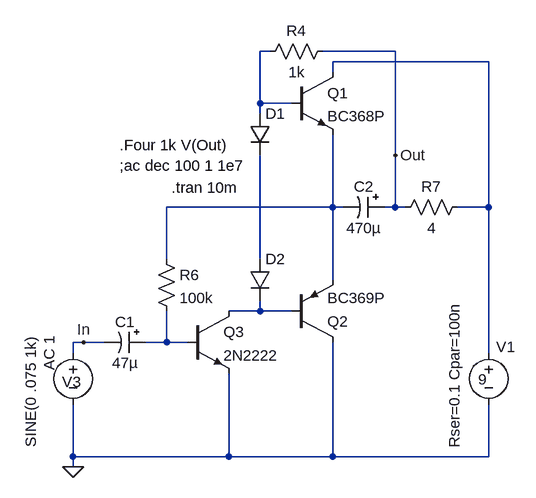
[diagram p0: schematic 9vMini25Ohms.asc]
9vMini25Ohms.asc, the LTspice schematic file:
Version 4
SHEET 1 880 756
WIRE -256 560 -256 544
WIRE -256 720 -256 640
WIRE -256 736 -256 720
WIRE -240 544 -256 544
WIRE -208 544 -240 544
WIRE -112 416 -112 336
WIRE -112 544 -144 544
WIRE -112 544 -112 496
WIRE -80 544 -112 544
WIRE -16 720 -256 720
WIRE -16 720 -16 592
WIRE 32 176 32 96
WIRE 32 192 32 176
WIRE 32 416 32 256
WIRE 32 496 -16 496
WIRE 32 496 32 480
WIRE 48 96 32 96
WIRE 80 176 32 176
WIRE 80 496 32 496
WIRE 144 128 144 112
WIRE 144 336 -112 336
WIRE 144 336 144 224
WIRE 144 448 144 336
WIRE 144 720 -16 720
WIRE 144 720 144 544
WIRE 160 336 144 336
WIRE 240 96 128 96
WIRE 240 256 240 96
WIRE 240 336 224 336
WIRE 240 336 240 256
WIRE 256 336 240 336
WIRE 384 112 144 112
WIRE 384 336 336 336
WIRE 384 336 384 112
WIRE 384 560 384 336
WIRE 384 720 144 720
WIRE 384 720 384 640
FLAG -256 736 0
FLAG 240 256 Out
FLAG -240 544 In
SYMBOL diode 16 192 R0
WINDOW 3 24 72 Invisible 0
SYMATTR Value 1N914
SYMATTR InstName D1
SYMBOL diode 16 416 R0
WINDOW 3 24 72 Invisible 0
SYMATTR Value 1N914
SYMATTR InstName D2
SYMBOL pnp2 80 544 M180
SYMATTR InstName Q2
SYMATTR Value BC369P
SYMBOL npn2 80 128 R0
SYMATTR InstName Q1
SYMATTR Value BC368P
SYMBOL npn2 -80 496 R0
SYMATTR InstName Q3
SYMATTR Value 2N2222
SYMBOL res 32 112 R270
WINDOW 0 32 56 VTop 0
WINDOW 3 0 56 VBottom 0
SYMATTR InstName R4
SYMATTR Value 1k
SYMATTR SpiceLine tol=1 pwr=0.1
SYMBOL res -128 400 R0
SYMATTR InstName R6
SYMATTR Value 100k
SYMATTR SpiceLine tol=1 pwr=0.1
SYMBOL res 240 352 R270
WINDOW 0 32 56 VTop 0
WINDOW 3 0 56 VBottom 0
SYMATTR InstName R7
SYMATTR Value 4
SYMATTR SpiceLine tol=1 pwr=0.1
SYMBOL voltage 384 544 R0
WINDOW 0 12 7 Left 0
WINDOW 3 -16 57 Left 0
WINDOW 123 0 0 Left 0
WINDOW 39 -53 -64 VRight 0
SYMATTR InstName V1
SYMATTR Value 9
SYMATTR SpiceLine Rser=0.1 Cpar=100n
SYMBOL voltage -256 544 R0
WINDOW 0 -17 61 Left 0
WINDOW 3 -65 -10 VRight 0
WINDOW 123 -37 -10 VRight 0
SYMATTR InstName V3
SYMATTR Value SINE(0 .075 1k)
SYMATTR Value2 AC 1
SYMATTR SpiceLine Rser=1k
SYMBOL polcap -144 528 R90
WINDOW 0 0 32 VBottom 0
WINDOW 3 32 32 VTop 0
SYMATTR InstName C1
SYMATTR Value 47µ
SYMATTR Description Capacitor
SYMATTR Type cap
SYMATTR SpiceLine V=16 Irms=155m Rser=0.8 MTBF=2000 Lser=0 mfg="Nichicon" pn="UPL1C470MAH" type="Al electrolytic" ppPkg=1
SYMBOL polcap 224 320 R90
WINDOW 0 0 32 VBottom 0
WINDOW 3 32 32 VTop 0
SYMATTR InstName C2
SYMATTR Value 470µ
SYMATTR Description Capacitor
SYMATTR Type cap
SYMATTR SpiceLine V=50 Irms=1.5 Rser=0.044 MTBF=5000 Lser=0 mfg="Nichicon" pn="UPL1H471MRH" type="Al electrolytic" ppPkg=1
TEXT -104 306 Left 0 !.tran 10m
TEXT -184 272 Left 0 !;ac dec 100 1 1e7
TEXT -184 240 Left 0 !.Four 1k V(Out)

The netlist it stands for:
* 9vMini25Ohms.asc
D1 N003 N004 1N914
D2 N004 N005 1N914
Q2 0 N005 N001 0 BC369P
Q1 N006 N003 N001 0 BC368P
Q3 N005 N002 0 0 2N2222
R4 N003 Out 1k tol=1 pwr=0.1
R6 N001 N002 100k tol=1 pwr=0.1
R7 Out N006 4 tol=1 pwr=0.1
V1 N006 0 9 Rser=0.1 Cpar=100n
V3 In 0 SINE(0 .075 1k) AC 1 Rser=1k
C1 N002 In 47µ V=16 Irms=155m Rser=0.8 MTBF=2000 Lser=0 mfg="Nichicon" pn="UPL1C470MAH" type="Al electrolytic" ppPkg=1
C2 Out N001 470µ V=50 Irms=1.5 Rser=0.044 MTBF=5000 Lser=0 mfg="Nichicon" pn="UPL1H471MRH" type="Al electrolytic" ppPkg=1
.model D D
.lib standard.dio
.model NPN NPN
.model PNP PNP
.lib standard.bjt
.tran 10m
;ac dec 100 1 1e7
.Four 1k V(Out)
.backanno
.end